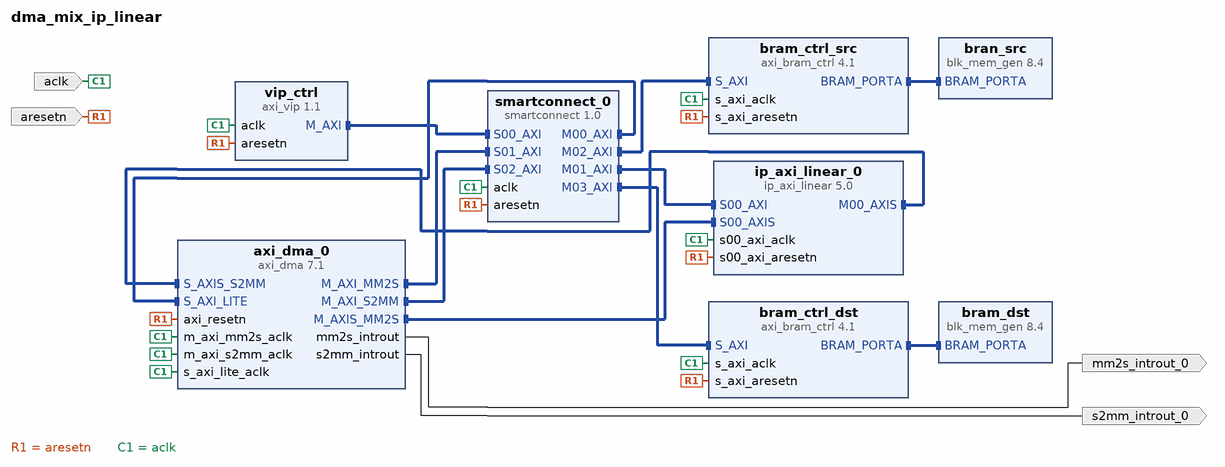
[diagram p0: block diagram of the top level]
# Vivado block design dma_mix_ip_linear, xck26-sfvc784-2LV-c, Vivado 2025.2
create_bd_design dma_mix_ip_linear

create_bd_port -dir I -type clk aclk
create_bd_port -dir I -type rst aresetn
create_bd_port -dir O -type intr mm2s_introut_0
create_bd_port -dir O -type intr s2mm_introut_0

create_bd_cell -type ip -vlnv xilinx.com:ip:axi_vip:1.1 vip_ctrl
set_property -dict [list \
  CONFIG.ADDR_WIDTH 32 \
  CONFIG.ARUSER_WIDTH 0 \
  CONFIG.AWUSER_WIDTH 0 \
  CONFIG.BUSER_WIDTH 0 \
  CONFIG.DATA_WIDTH 32 \
  CONFIG.HAS_BRESP 1 \
  CONFIG.HAS_BURST 1 \
  CONFIG.HAS_CACHE 1 \
  CONFIG.HAS_LOCK 1 \
  CONFIG.HAS_PROT 1 \
  CONFIG.HAS_QOS 1 \
  CONFIG.HAS_REGION 1 \
  CONFIG.HAS_RRESP 1 \
  CONFIG.HAS_WSTRB 1 \
  CONFIG.ID_WIDTH 0 \
  CONFIG.INTERFACE_MODE MASTER \
  CONFIG.PROTOCOL AXI4 \
  CONFIG.READ_WRITE_MODE READ_WRITE \
  CONFIG.RUSER_WIDTH 0 \
  CONFIG.SUPPORTS_NARROW 1 \
  CONFIG.WUSER_WIDTH 0 \
] [get_bd_cells vip_ctrl]
create_bd_cell -type ip -vlnv xilinx.com:ip:smartconnect:1.0 smartconnect_0
set_property -dict {CONFIG.NUM_MI 4 CONFIG.NUM_SI 3} [get_bd_cells smartconnect_0]
create_bd_cell -type ip -vlnv xilinx.com:ip:axi_dma:7.1 axi_dma_0
set_property -dict {CONFIG.c_include_sg 0} [get_bd_cells axi_dma_0]
create_bd_cell -type ip -vlnv xilinx.com:ip:axi_bram_ctrl:4.1 bram_ctrl_src
set_property -dict {CONFIG.SINGLE_PORT_BRAM 1} [get_bd_cells bram_ctrl_src]
create_bd_cell -type ip -vlnv xilinx.com:ip:axi_bram_ctrl:4.1 bram_ctrl_dst
set_property -dict {CONFIG.SINGLE_PORT_BRAM 1} [get_bd_cells bram_ctrl_dst]
create_bd_cell -type ip -vlnv xilinx.com:ip:blk_mem_gen:8.4 bran_src
create_bd_cell -type ip -vlnv xilinx.com:ip:blk_mem_gen:8.4 bram_dst
create_bd_cell -type ip -vlnv xilinx.com:user:ip_axi_linear:5.0 ip_axi_linear_0
set_property -dict {CONFIG.D_HEAD 16 CONFIG.N_PE 16 CONFIG.SEQ_LEN 16} [get_bd_cells ip_axi_linear_0]

# ---- connections ----

connect_bd_intf_net [get_bd_intf_pins axi_dma_0/M_AXIS_MM2S] [get_bd_intf_pins ip_axi_linear_0/S00_AXIS]
connect_bd_intf_net [get_bd_intf_pins axi_dma_0/M_AXI_MM2S] [get_bd_intf_pins smartconnect_0/S01_AXI]
connect_bd_intf_net [get_bd_intf_pins axi_dma_0/M_AXI_S2MM] [get_bd_intf_pins smartconnect_0/S02_AXI]
connect_bd_intf_net [get_bd_intf_pins bram_ctrl_dst/BRAM_PORTA] [get_bd_intf_pins bram_dst/BRAM_PORTA]
connect_bd_intf_net [get_bd_intf_pins bram_ctrl_src/BRAM_PORTA] [get_bd_intf_pins bran_src/BRAM_PORTA]
connect_bd_intf_net [get_bd_intf_pins ip_axi_linear_0/M00_AXIS] [get_bd_intf_pins axi_dma_0/S_AXIS_S2MM]
connect_bd_intf_net [get_bd_intf_pins smartconnect_0/M00_AXI] [get_bd_intf_pins axi_dma_0/S_AXI_LITE]
connect_bd_intf_net [get_bd_intf_pins smartconnect_0/M01_AXI] [get_bd_intf_pins ip_axi_linear_0/S00_AXI]
connect_bd_intf_net [get_bd_intf_pins smartconnect_0/M02_AXI] [get_bd_intf_pins bram_ctrl_src/S_AXI]
connect_bd_intf_net [get_bd_intf_pins smartconnect_0/M03_AXI] [get_bd_intf_pins bram_ctrl_dst/S_AXI]
connect_bd_intf_net [get_bd_intf_pins vip_ctrl/M_AXI] [get_bd_intf_pins smartconnect_0/S00_AXI]
connect_bd_net [get_bd_pins axi_dma_0/mm2s_introut] [get_bd_ports mm2s_introut_0]
connect_bd_net [get_bd_pins axi_dma_0/s2mm_introut] [get_bd_ports s2mm_introut_0]
connect_bd_net -net axi_resetn_0_1 [get_bd_ports aresetn] \
  [get_bd_pins axi_dma_0/axi_resetn] [get_bd_pins vip_ctrl/aresetn] [get_bd_pins smartconnect_0/aresetn] \
  [get_bd_pins bram_ctrl_src/s_axi_aresetn] [get_bd_pins bram_ctrl_dst/s_axi_aresetn] \
  [get_bd_pins ip_axi_linear_0/s00_axi_aresetn]
connect_bd_net -net s_axi_lite_aclk_0_1 [get_bd_ports aclk] \
  [get_bd_pins axi_dma_0/s_axi_lite_aclk] [get_bd_pins vip_ctrl/aclk] [get_bd_pins smartconnect_0/aclk] \
  [get_bd_pins axi_dma_0/m_axi_mm2s_aclk] [get_bd_pins axi_dma_0/m_axi_s2mm_aclk] [get_bd_pins bram_ctrl_src/s_axi_aclk] \
  [get_bd_pins bram_ctrl_dst/s_axi_aclk] [get_bd_pins ip_axi_linear_0/s00_axi_aclk]

# ---- address map ----
assign_bd_address -offset 0x00000000 -range 16K -target_address_space [get_bd_addr_spaces axi_dma_0/Data_MM2S] [get_bd_addr_segs bram_ctrl_src/S_AXI/Mem0]
exclude_bd_addr_seg -offset 0x41E00000 -range 64K -target_address_space [get_bd_addr_spaces axi_dma_0/Data_MM2S] [get_bd_addr_segs axi_dma_0/S_AXI_LITE/Reg]
exclude_bd_addr_seg -offset 0x44A00000 -range 64K -target_address_space [get_bd_addr_spaces axi_dma_0/Data_MM2S] [get_bd_addr_segs ip_axi_linear_0/S00_AXI/S00_AXI_reg]
exclude_bd_addr_seg -offset 0xC0000000 -range 8K -target_address_space [get_bd_addr_spaces axi_dma_0/Data_MM2S] [get_bd_addr_segs bram_ctrl_dst/S_AXI/Mem0]
assign_bd_address -offset 0x00010000 -range 16K -target_address_space [get_bd_addr_spaces axi_dma_0/Data_S2MM] [get_bd_addr_segs bram_ctrl_dst/S_AXI/Mem0]
exclude_bd_addr_seg -offset 0x41E00000 -range 64K -target_address_space [get_bd_addr_spaces axi_dma_0/Data_S2MM] [get_bd_addr_segs axi_dma_0/S_AXI_LITE/Reg]
exclude_bd_addr_seg -offset 0x44A00000 -range 64K -target_address_space [get_bd_addr_spaces axi_dma_0/Data_S2MM] [get_bd_addr_segs ip_axi_linear_0/S00_AXI/S00_AXI_reg]
exclude_bd_addr_seg -offset 0xC2000000 -range 8K -target_address_space [get_bd_addr_spaces axi_dma_0/Data_S2MM] [get_bd_addr_segs bram_ctrl_src/S_AXI/Mem0]
assign_bd_address -offset 0x00000000 -range 16K -target_address_space [get_bd_addr_spaces vip_ctrl/Master_AXI] [get_bd_addr_segs bram_ctrl_src/S_AXI/Mem0]
assign_bd_address -offset 0x00010000 -range 16K -target_address_space [get_bd_addr_spaces vip_ctrl/Master_AXI] [get_bd_addr_segs bram_ctrl_dst/S_AXI/Mem0]
assign_bd_address -offset 0x40000000 -range 64K -target_address_space [get_bd_addr_spaces vip_ctrl/Master_AXI] [get_bd_addr_segs axi_dma_0/S_AXI_LITE/Reg]
assign_bd_address -offset 0x40010000 -range 64K -target_address_space [get_bd_addr_spaces vip_ctrl/Master_AXI] [get_bd_addr_segs ip_axi_linear_0/S00_AXI/S00_AXI_reg]

validate_bd_design
save_bd_design
